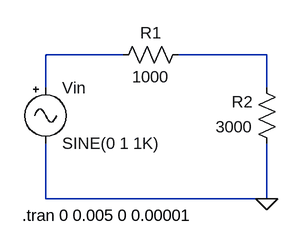
[diagram p0: schematic ELEN 115 Lab 1 Part 3.asc]
ELEN 115 Lab 1 Part 3.asc, the LTspice schematic file:
Version 4
SHEET 1 880 680
WIRE 176 64 64 64
WIRE 384 64 256 64
WIRE 64 112 64 64
WIRE 384 112 384 64
WIRE 64 272 64 192
WIRE 384 272 384 192
WIRE 384 272 64 272
FLAG 384 272 0
SYMBOL res 272 48 R90
WINDOW 0 0 56 VBottom 2
WINDOW 3 32 56 VTop 2
SYMATTR InstName R1
SYMATTR Value 1000
SYMBOL res 400 208 R180
WINDOW 0 36 76 Left 2
WINDOW 3 36 40 Left 2
SYMATTR InstName R2
SYMATTR Value 3000
SYMBOL Misc\\signal 64 96 R0
SYMATTR InstName Vin
TEXT 30 296 Left 2 !.tran 0 0.005 0 0.00001

The netlist it stands for:
* ELEN 115 Lab 1 Part 3.asc
R1 N002 N001 1000
R2 0 N002 3000
Vin N001 0 SINE(0 1 1K)
.tran 0 0.005 0 0.00001
.backanno
.end